# Altium schematic sheet Switch Solar.SchDoc
size A3; Rule: PcbType=ProtelPcb; Rule: PcbType=ProtelPcb
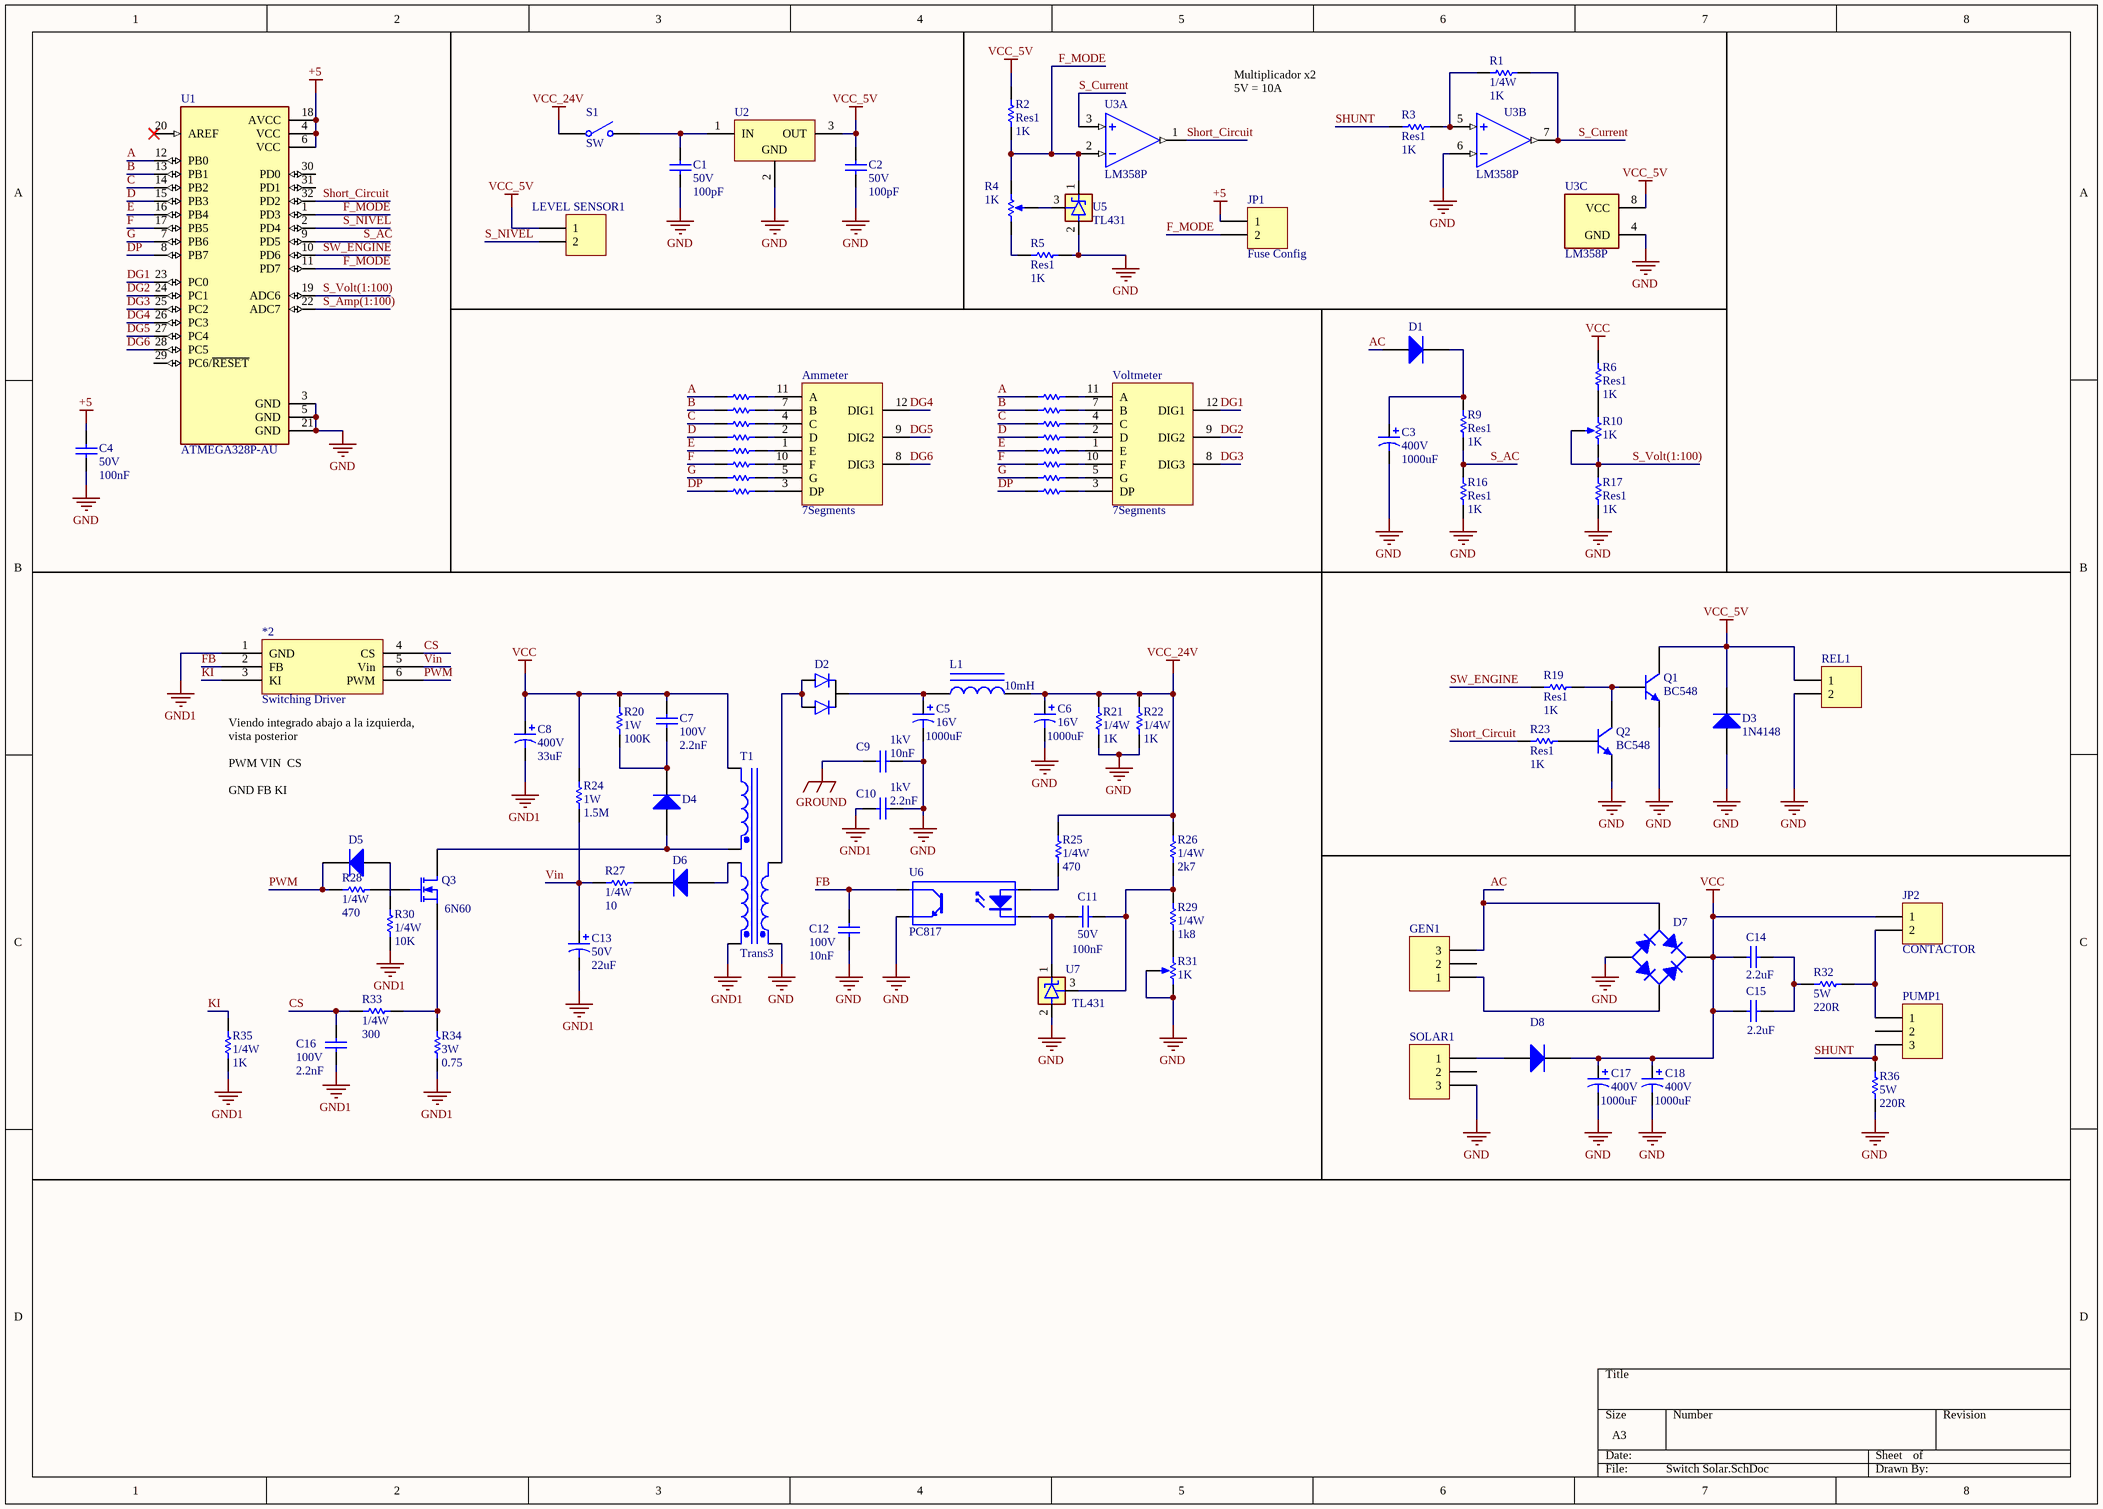
[diagram p0: Switch Solar.SchDoc]

## Parts
(Parts that share a designator on the sheet are numbered #1, #2 ... from top to bottom, then left to right.)
*2  Switching Driver  [8-VSSOP]
Ammeter  7Segments  [3x7 segments]
C1  50V  value 100pF  [Capacitor ceramico]
C2  50V  value 100pF  [Capacitor ceramico]
C3  400V  value 1000uF  [CAP RADIAL 6.3mm]
C4  50V  value 100nF  [Capacitor ceramico]
C5  16V  value 1000uF  [CAP RADIAL 10mm]
C6  16V  value 1000uF  [CAP RADIAL 10mm]
C7  100V  value 2.2nF  [CAP POLY PITCH 7.5 y 10mm]
C8  400V  value 33uF  [CAP 18mm x 37 mm]
C9  1kV  value 10nF  [Varistor 10D]
C10  1kV  value 2.2nF  [Varistor 10D]
C11  50V  value 100nF  [Capacitor ceramico]
C12  100V  value 10nF  [CAP POLY PITCH 7.5 y 10mm]
C13  50V  value 22uF  [CAP RADIAL 6.3mm]
C14  value 2.2uF  [CAP POLY PITCH 27.5mm]  (hidden comment: Cap)
C15  value 2.2uF  [CAP POLY PITCH 27.5mm]  (hidden comment: Cap)
C16  100V  value 2.2nF  [CAP POLY PITCH 7.5 y 10mm]
C17  400V  value 1000uF  [CAP RADIAL 6.3mm]
C18  400V  value 1000uF  [CAP RADIAL 6.3mm]
D1  (no value)  [DO-35 Zener]
D2  MUR1620CT  [TO220]  (value not drawn)
D3  1N4148  [DO-35 Zener]
D4  Diode 1N4007  [DO-41]  (value not drawn)
D5  Diode 1N4007  [DO-41]  (value not drawn)
D6  Diode 1N4007  [DO-41]  (value not drawn)
D7  Bridge1  [Puente D 1.5A]  (value not drawn)
D8  (no value)  [DO-35 Zener]
GEN1  GEN  [Bornera x 3 Enchufable - duplicate]  (value not drawn)
JP1  Fuse Config  [Jumper 2.54mm]
JP2  CONTACTOR  [BORNERA x2 5mm]
L1  value 10mH  [Inductor Iron]  (hidden comment: Inductor Iron)
LEVEL_SENSOR1  SENSOR  [BORNERA x2 5mm]  (value not drawn)
PUMP1  PUMP  [Bornera x 3 Enchufable - duplicate]  (value not drawn)
Q1  BC548  [TO-92A]
Q2  BC548  [TO-92A]
Q3  6N60  [TO220]
R1  1/4W  value 1K  [Res 1/4W]
R2  Res1  value 1K  [Res 1/4W]
R3  Res1  value 1K  [Res 1/4W]
R4  value 1K  [TRIMPOT]  (hidden comment: Trimpot)
R5  Res1  value 1K  [Res 1/4W]
R6  Res1  value 1K  [Res 1/4W]
R7#1  1/4W  [Res 1/4W]  (value not drawn)
R7#2  1/4W  [Res 1/4W]  (value not drawn)
R8#1  1/4W  [Res 1/4W]  (value not drawn)
R8#2  1/4W  [Res 1/4W]  (value not drawn)
R9  Res1  value 1K  [Res 1/4W]
R10  value 1K  [TRIMPOT]  (hidden comment: Trimpot)
R11#1  1/4W  [Res 1/4W]  (value not drawn)
R11#2  1/4W  [Res 1/4W]  (value not drawn)
R12#1  1/4W  [Res 1/4W]  (value not drawn)
R12#2  1/4W  [Res 1/4W]  (value not drawn)
R13#1  1/4W  [Res 1/4W]  (value not drawn)
R13#2  1/4W  [Res 1/4W]  (value not drawn)
R14#1  1/4W  [Res 1/4W]  (value not drawn)
R14#2  1/4W  [Res 1/4W]  (value not drawn)
R15#1  1/4W  [Res 1/4W]  (value not drawn)
R15#2  1/4W  [Res 1/4W]  (value not drawn)
R16  Res1  value 1K  [Res 1/4W]
R17  Res1  value 1K  [Res 1/4W]
R18#1  1/4W  [Res 1/4W]  (value not drawn)
R18#2  1/4W  [Res 1/4W]  (value not drawn)
R19  Res1  value 1K  [Res 1/4W]
R20  1W  value 100K  [Res 1/4W]
R21  1/4W  value 1K  [Res 1/4W]
R22  1/4W  value 1K  [Res 1/4W]
R23  Res1  value 1K  [Res 1/4W]
R24  1W  value 1.5M  [Res 1/4W]
R25  1/4W  value 470  [Res 1/4W]
R26  1/4W  value 2k7  [Res 1/4W]
R27  1/4W  value 10  [Res 1/4W]
R28  1/4W  value 470  [Res 1/4W]
R29  1/4W  value 1k8  [Res 1/4W]
R30  1/4W  value 10K  [Res 1/4W]
R31  value 1K  [TRIMPOT]  (hidden comment: Trimpot)
R32  5W  value 220R  [RES 5W]
R33  1/4W  value 300  [Res 1/4W]
R34  3W  value 0.75  [Res 1/2W]
R35  1/4W  value 1K  [Res 1/4W]
R36  5W  value 220R  [RES 5W]
REL1  REL  [BORNERA x2 5mm]  (value not drawn)
S1  SW  [SPST-2]
SOLAR1  SOLAR  [Bornera x 3 Enchufable - duplicate]  (value not drawn)
T1  Trans3  [TRAFO_KBD4118]
U1  ATMEGA328P-AU  [QFP80P900X900X120-32N]
U2  LM78M05CT/NOPB  [T03B]  (value not drawn)
U3  LM358P  [8-VSSOP]  (parts A,B,C of 3)
U5  TL431  [TO92W]
U6  PC817  [DIP SWITCH 2POS]
U7  TL431  [TO92W]
Voltmeter  7Segments  [3x7 segments]

## Nets
+5: C4.2 JP1.1 U1.4(VCC) U1.6(VCC) U1.18(AVCC)
GND: C1.1 C2.1 C3.2 C4.1 C5.2 C6.2 C9.1 C10.1 C12.1 C17.2 C18.2 D3.1(A) D7.3(A) Q1.1(E) Q2.1(E) R5.1 R16.1 R17.1 R21.2 R22.2 R31.2(BOT) R31.3(TAP) R36.2 REL1.2 SOLAR1.3 T1.1(Pri+) U1.3(GND) U1.5(GND) U1.21(GND) U2.2(GND) U3.4(GND) U3.6(-IN2) U5.2(ANODE) U6.3(E) U7.2(ANODE)
GND1: *2.1(GND) C8.2 C10.2 C13.2 C16.1 R30.2 R34.2 R35.2 T1.3(Sec1+)
GROUND: C9.2
VCC: C7.1 C8.1 C14.2 C15.2 C17.1 C18.1 D7.1(K) D8.2(K) JP2.1 R6.2 R20.2 R24.2 T1.6(Sec2-)
VCC_5V: C2.2 D3.2(K) LEVEL_SENSOR1.1 Q1.3(C) R2.2 REL1.1 U2.3(OUT) U3.8(VCC)
VCC_24V: C6.1 L1.2 R21.1 R22.1 R25.1 R26.1 S1.1(COMMON)
A: R7#1.2 R7#2.2 U1.12(PB0)
AC: D1.1(A) D7.4(C) GEN1.3
B: R8#1.2 R8#2.2 U1.13(PB1)
C: R11#1.2 R11#2.2 U1.14(PB2)
CS: *2.4(CS) C16.2 R33.1
D: R12#1.2 R12#2.2 U1.15(PB3)
DG1: U1.23(PC0) Voltmeter.12(DIG1)
DG2: U1.24(PC1) Voltmeter.9(DIG2)
DG3: U1.25(PC2) Voltmeter.8(DIG3)
DG4: Ammeter.12(DIG1) U1.26(PC3)
DG5: Ammeter.9(DIG2) U1.27(PC4)
DG6: Ammeter.8(DIG3) U1.28(PC5)
DP: R18#1.2 R18#2.2 U1.8(PB7)
E: R13#1.2 R13#2.2 U1.16(PB4)
F: R14#1.2 R14#2.2 U1.17(PB5)
F_MODE: JP1.2 R2.1 R4.2(BOT) U1.1(PD3) U1.11(PD7) U3.2(-IN1) U5.1(CATHODE)
FB: *2.2(FB) C12.2 U6.4(C)
G: R15#1.2 R15#2.2 U1.7(PB6)
KI: *2.3(KI) R35.1
PWM: *2.6(PWM) D5.2(K) R28.1
S_AC: R9.1 R16.2 U1.9(PD5)
S_Amp(1:100): U1.22(ADC7)
S_Current: R1.2 U3.3(+IN1) U3.7(OUT2)
S_NIVEL: LEVEL_SENSOR1.2 U1.2(PD4)
S_Volt(1:100): R10.2(BOT) R10.3(TAP) R17.2 U1.19(ADC6)
Short_Circuit: R23.2 U1.32(PD2) U3.1(OUT1)
SHUNT: PUMP1.3 R3.1 R36.1
SW_ENGINE: R19.2 U1.10(PD6)
Vin: *2.5(Vin) C13.1 R24.1 R27.1
NetAmmeter_1: Ammeter.1(E) R13#1.1
NetAmmeter_2: Ammeter.2(D) R12#1.1
NetAmmeter_3: Ammeter.3(DP) R18#1.1
NetAmmeter_4: Ammeter.4(C) R11#1.1
NetAmmeter_5: Ammeter.5(G) R15#1.1
NetAmmeter_7: Ammeter.7(B) R8#1.1
NetAmmeter_10: Ammeter.10(F) R14#1.1
NetAmmeter_11: Ammeter.11(A) R7#1.1
NetC1_2: C1.2 S1.2(NO) U2.1(IN)
NetC3_1: C3.1 D1.2(K) R9.2
NetC5_1: C5.1 D2.2(C) L1.1
NetC7_2: C7.2 D4.2(K) R20.1
NetC11_1: C11.1 U6.2(K) U7.1(CATHODE)
NetC11_2: C11.2 R26.2 R29.1 U7.3(REF)
NetC14_1: C14.1 C15.1 R32.2
NetD2_1: D2.1(A1) D2.3(A2) T1.2(Pri-)
NetD4_1: D4.1(A) Q3.2(D) T1.5(Sec2+)
NetD5_1: D5.1(A) R30.1
NetD6_1: D6.1(A) T1.4(Sec1-)
NetD6_2: D6.2(K) R27.2
NetD7_2: D7.2(C) GEN1.1
NetD8_1: D8.1(A) SOLAR1.1
NetJP2_2: JP2.2 PUMP1.1 R32.1
NetQ1_2: Q1.2(B) Q2.3(C) R19.1
NetQ2_2: Q2.2(B) R23.1
NetQ3_1: Q3.1(G) R28.2
NetQ3_3: Q3.3(S) R33.2 R34.1
NetR1_1: R1.1 R3.2 U3.5(+IN2)
NetR4_1: R4.1(TOP) R5.2
NetR4_3: R4.3(TAP) U5.3(REF)
NetR6_1: R6.1 R10.1(TOP)
NetR7#2_1: R7#2.1 Voltmeter.11(A)
NetR8#2_1: R8#2.1 Voltmeter.7(B)
NetR11#2_1: R11#2.1 Voltmeter.4(C)
NetR12#2_1: R12#2.1 Voltmeter.2(D)
NetR13#2_1: R13#2.1 Voltmeter.1(E)
NetR14#2_1: R14#2.1 Voltmeter.10(F)
NetR15#2_1: R15#2.1 Voltmeter.5(G)
NetR18#2_1: R18#2.1 Voltmeter.3(DP)
NetR25_2: R25.2 U6.1(A)
NetR29_2: R29.2 R31.1(TOP)

Not connected (* = marked no-connect by the designer): GEN1 2; PUMP1 2; SOLAR1 2; U1 20(AREF)* 29(PC6/~{RESET}) 30(PD0) 31(PD1)

## Notes on the sheet
- Multiplicador x2
  5V = 10A
- (near *2) Viendo integrado abajo a la izquierda,
  vista posterior
  PWM	VIN 	CS
  GND	FB	KI

## Library data of the parts
Ammeter Voltmeter = 7seg 3digitos: Manufacturer PN: 7segmentos x3digitos
C1 C2 = Cap: Capacitor; Manufacturer PN: CAP CER 100pF
C3 C17 C18 = Cap Pol1: Polarized Capacitor (Radial); Manufacturer PN: CAP RAD 1000uF x400
C4 = Cap: Capacitor; Manufacturer PN: CAP CER 100nF
C5 C6 = Cap Pol1: Polarized Capacitor (Radial); Manufacturer PN: CAP RAD 1000uF x16V
C7 C16 = Cap: Capacitor; Manufacturer PN: Cap Pol 2.2nf x100V
C8 = Cap Pol1: Polarized Capacitor (Radial); Manufacturer PN: CAP RAD 33uF x400V
C9 = Cap: Capacitor; Manufacturer PN: Cap Pol 10nF x 1kV
C10 = Cap: Capacitor; Manufacturer PN: Cap Pol 2.2nF x 1kV
C11 = Cap: Capacitor; Manufacturer PN: CAP CER 100nF x50V
C12 = Cap: Capacitor; Manufacturer PN: Cap Pol 10nf x100V
C13 = Cap Pol1: Polarized Capacitor (Radial); Manufacturer PN: CAP Rad 22uf x50V
C14 C15 = Cap: Capacitor; Manufacturer PN: 2.2uF 650V
D1 D8 = Diode 1N4007: 1 Amp General Purpose Rectifier; Manufacturer PN: Diodo 15A
D2 = MUR1620CT: 25ns, 16A, 200V, Ultra Fast Recovery Rectifier; Manufacture PN: *
D3-D6 = Diode 1N4007: 1 Amp General Purpose Rectifier
  D3: Manufacturer PN: 1N4148
  D4-D6: Manufacturer PN: *
D7 = Bridge1: Full Wave Diode Bridge; Manufacturer PN: Puente Diodos 25A
GEN1 PUMP1 SOLAR1 = Header 3: Header, 3-Pin; Manufacturer PN: Bornera Enchufable 3x5mm
JP1 JP2 REL1 = Header 2: Header, 2-Pin; Manufacturer PN: Tira Pines
L1 = Inductor Iron: Magnetic-Core Inductor; Manufacturer PN: Inductanctor con nucleo
LEVEL_SENSOR1 = Header 2: Header, 2-Pin; Manufacturer PN: Bornera 2x5mm
Q1 Q2 = 2N3904: NPN General Purpose Amplifier; Manufacturer PN: BC548
Q3 = MOSFET-N: N-Channel MOSFET; Manufacturer PN: 6N60
R1-R3 R5 R6 R9 R16 R17 R19 R21-R23 = Res1: Resistor; Manufacturer PN: RES 1k 1/4W
R4 R10 R31 = RPot: Potentiometer; Manufacturer PN: Trimpot
R7#1 R7#2 R8#1 R8#2 R11#1 R11#2 R12#1 R12#2 R13#1 R13#2 R14#1 R14#2 R15#1 R15#2 R18#1 R18#2 = Res1: Resistor; Manufacturer PN: RES 180 1/4W; Value: 180
R20 = Res1: Resistor; Manufacture PN: RES 100k 1W
R24 = Res1: Resistor; Manufacture PN: RES 1.5M 1W
R25 R28 = Res1: Resistor; Manufacturer PN: RES 470 1/4W
R26 = Res1: Resistor; Manufacturer PN: RES 2k7 1/4W
R27 = Res1: Resistor; Manufacturer PN: RES 10 1/4W
R29 = Res1: Resistor; Manufacturer PN: RES 1k8 1/4W
R30 = Res1: Resistor; Manufacturer PN: RES 10k 1/4W
R32 R36 = Res1: Resistor; Manufacturer PN: RES 330 5W
R33 = Res1: Resistor; Manufacturer PN: RES 300 1/4W
R34 = Res1: Resistor; Manufacturer PN: RES 0.75 3W
R35 = Res1: Resistor; Manufacturer PN: RES 91k 1/4W
S1 = SW-SPST: Single-Pole, Single-Throw Switch
T1 = Trans3: Three-winding Transformer (Non-Ideal); Manufacturer PN: *
U1 = ATMEGA328P-AU: ATmega Series 20 MHz 32 KB Flash 2 KB SRAM 8-Bit Microcontroller - TQFP-32; Value: *; Availability: Unavailable; Price: None; Package: None; MP: ATMEGA328P-AU
U2 = LM78M05CT/NOPB: 3-Terminal Positive Voltage Regulators, 3-pin TO-220, Pb-Free; Manufacturer PN: LM7805
U3 = LM358P: <a href="https://pricing.snapeda.com/parts/LM358P/Texas%20Instruments/view-part?ref=eda">Check prices</a>; Manufacturer PN: LM358D
U5 U7 = TL431CLP: Adjustable precision shunt regulator 3-TO-92 0 to 70; Manufacturer PN: TL431
U6 = Optoisolator1: 4-Pin Phototransistor Optocoupler; Manufacturer PN: PC817